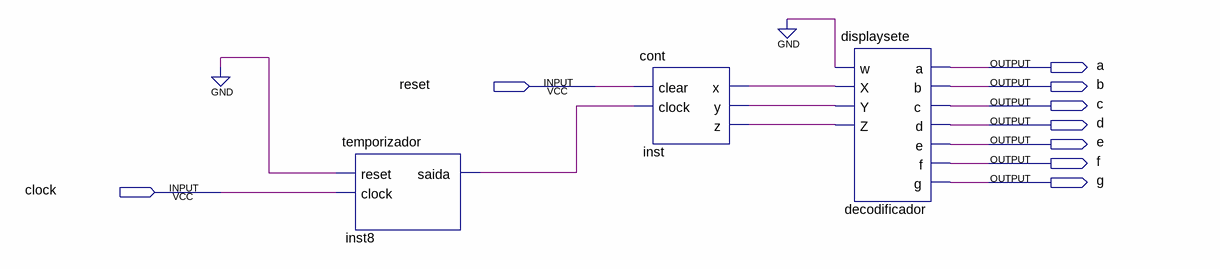
[diagram p0: schematic sheet]
// Quartus schematic contdec.bdf as structural Verilog: 3 symbols, 9 pins
module contdec (
  input  reset,
  input  clock,
  output a,
  output b,
  output c,
  output d,
  output e,
  output f,
  output g
);

  wire inst8_saida, inst_x, inst_y, inst_z;

  temporizador inst8 (.reset(1'b0), .clock(clock), .saida(inst8_saida));
  cont inst (.clear(reset), .clock(inst8_saida), .x(inst_x), .y(inst_y), .z(inst_z));
  displaysete decodificador (
    .w(1'b0), .X(inst_x), .Y(inst_y), .Z(inst_z), .a(a), .b(b), .c(c), .d(d), .e(e), .f(f), .g(g));
endmodule
